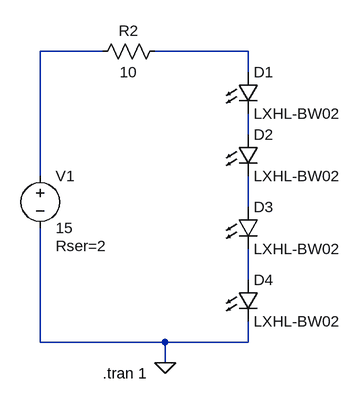
[diagram p0: schematic LEDs1.asc]
LEDs1.asc, the LTspice schematic file:
Version 4
SHEET 1 880 680
WIRE -96 32 -192 32
WIRE 128 32 -16 32
WIRE 128 64 128 32
WIRE 128 160 128 128
WIRE -192 224 -192 32
WIRE 128 272 128 224
WIRE 128 384 128 336
WIRE -192 480 -192 304
WIRE 0 480 -192 480
WIRE 128 480 128 448
WIRE 128 480 0 480
WIRE 0 512 0 480
FLAG 0 512 0
SYMBOL LED 112 64 R0
SYMATTR InstName D1
SYMATTR Value LXHL-BW02
SYMBOL LED 112 160 R0
SYMATTR InstName D2
SYMATTR Value LXHL-BW02
SYMBOL LED 112 272 R0
SYMATTR InstName D3
SYMATTR Value LXHL-BW02
SYMBOL LED 112 384 R0
SYMATTR InstName D4
SYMATTR Value LXHL-BW02
SYMBOL voltage -192 208 R0
WINDOW 123 0 0 Left 0
WINDOW 39 24 124 Left 2
SYMATTR InstName V1
SYMATTR Value 15
SYMATTR SpiceLine Rser=2
SYMBOL res 0 16 R90
WINDOW 0 0 56 VBottom 2
WINDOW 3 32 56 VTop 2
SYMATTR InstName R2
SYMATTR Value 10
TEXT -96 528 Left 2 !.tran 1

The netlist it stands for:
* LEDs1.asc
D1 N002 N003 LXHL-BW02
D2 N003 N004 LXHL-BW02
D3 N004 N005 LXHL-BW02
D4 N005 0 LXHL-BW02
V1 N001 0 15 Rser=2
R2 N002 N001 10
.model D D
.lib standard.dio
.tran 1
.backanno
.end